# EAGLE schematic Front v1 (EAGLE 9.7.0)
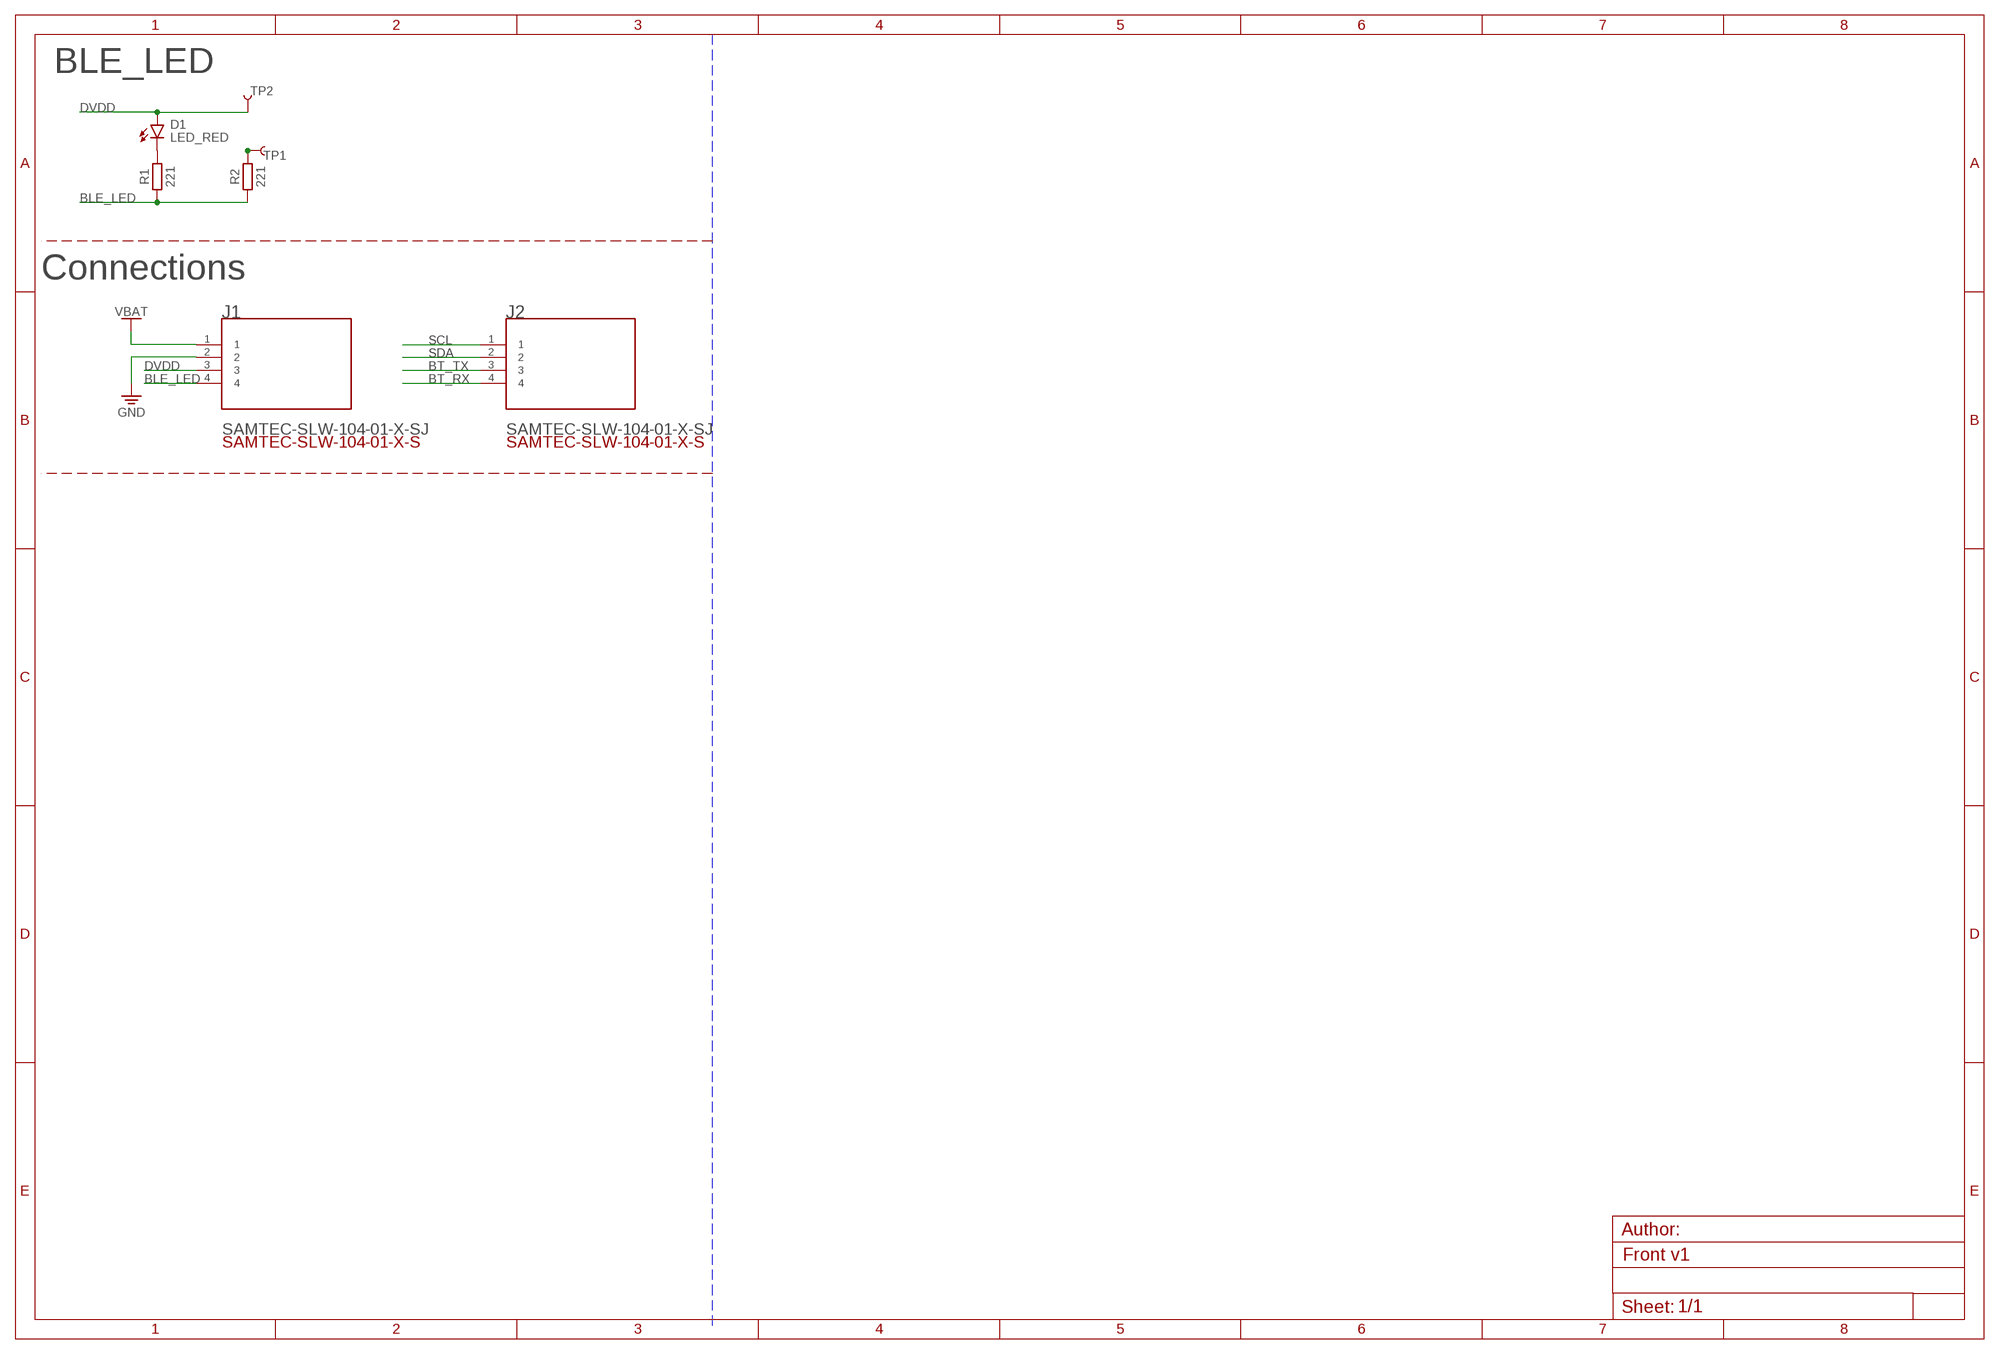
[diagram p0: schematic, sheet 1]

## Parts
D1  LED_RED  CHIP-ROUND-R_0603  [LEDC1608X65N_RND-R]
J1  SAMTEC-SLW-104-01-X-SJ  [SAMTEC-SLW-104-01-X-S]
J2  SAMTEC-SLW-104-01-X-SJ  [SAMTEC-SLW-104-01-X-S]
R1  221  R_CHIP-0603(1608-METRIC)  [RESC1608X60]
R2  221  R_CHIP-0603(1608-METRIC)  [RESC1608X60]
TP1  TEST-POINT3X5  [PAD.03X.05]
TP2  TEST-POINT3X5  [PAD.03X.05]

## Nets
BLE_LED: J1.4 R1.1 R2.1
BT_RX: J2.4
BT_TX: J2.3
DVDD: D1.A J1.3 TP2.P$1
GND: J1.2
N$1: R2.2 TP1.P$1
N$3: D1.C R1.2
SCL: J2.1
SDA: J2.2
VCC: J1.1 ; supply symbol labelled VBAT

## Notes on the sheet
- BLE_LED
- Connections

## Library data of the parts
D1 = LED:CHIP-ROUND-R: LED - Generic; CATEGORY: LED; COLOR: RED; DESCRIPTION: CHIP LED ROUND; SUB-CATEGORY: CHIP; TYPE: ROUND_TOP
J1 J2 = SAMTEC-SLW-104-01-X-S:SAMTEC-SLW-104-01-X-S
R1 R2 = Resistor:R: Resistor Fixed - Generic; CATEGORY: Resistor; SUB-CATEGORY: Fixed
TP1 TP2 = SparkFun-Connectors:TEST-POINT: SparkFun Test Points Bare copper test points for troubleshooting or In-Circuit-Testing. These are used by our Production team for verifying production board runs using pogo-pins on test beds. SparkFun Products: SparkFun LSM9DS1 Breakout <https://www.sparkfun.com/products/13284> SparkFun PSOC <https://www.sparkfun.com/products/13714> SparkFun Load Cell Amplifier <https://www.sparkfun.com/products/13879>